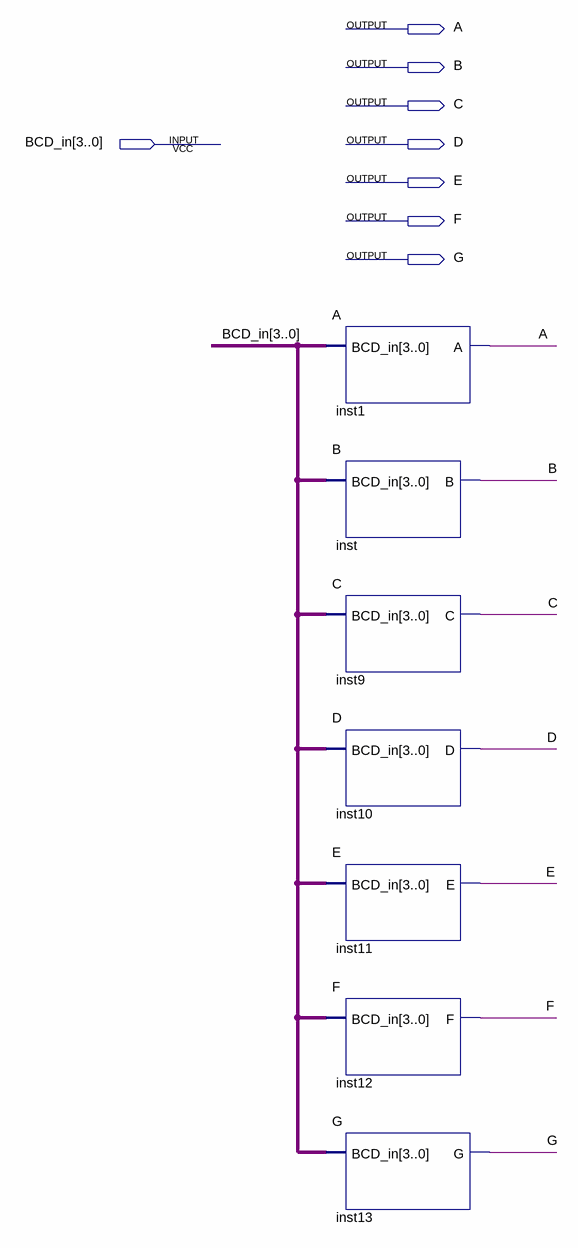
[diagram p0: schematic sheet]
// Quartus schematic BCD_7_SEGMENTS_DECODER.bdf as structural Verilog: 7 symbols, 8 pins
module BCD_7_SEGMENTS_DECODER (
  input  [3:0] BCD_in,
  output A,
  output B,
  output C,
  output D,
  output E,
  output F,
  output G
);

  A inst1 (.BCD_in(BCD_in), .A(A));
  B inst (.BCD_in(BCD_in), .B(B));
  C inst9 (.BCD_in(BCD_in), .C(C));
  D inst10 (.BCD_in(BCD_in), .D(D));
  E inst11 (.BCD_in(BCD_in), .E(E));
  F inst12 (.BCD_in(BCD_in), .F(F));
  G inst13 (.BCD_in(BCD_in), .G(G));
endmodule
